# EAGLE schematic isd primary mcu (EAGLE 9.6.2)
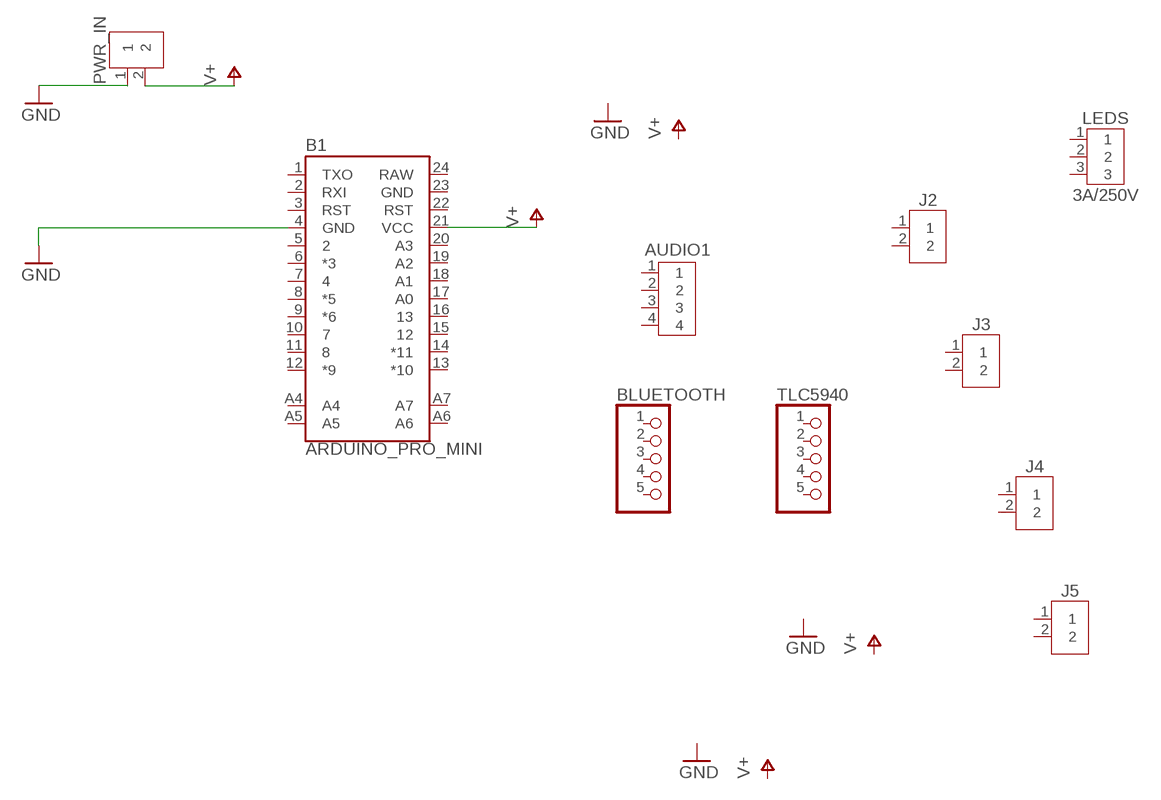
[diagram p0: schematic, sheet 1]

## Parts
AUDIO1  B4B-XH-A  [B4B-XH-A]
B1  ARDUINO_PRO_MINI  [ARDUINO_PRO_MINI]
BLUETOOTH  PINHD-1X5  [1X05]
J2  B2B-XH-A  [B2B-XH-A]
J3  B2B-XH-A  [B2B-XH-A]
J4  B2B-XH-A  [B2B-XH-A]
J5  B2B-XH-A  [B2B-XH-A]
LEDS  3A/250V  B3B-XH-A  [B3B-XH-A]
PWR_IN  B2B-XH-A  [B2B-XH-A]
TLC5940  PINHD-1X5  [1X05]

## Nets
GND: B1.4(GND) PWR_IN.1
V+: B1.21(VCC) PWR_IN.2
Unconnected: AUDIO1.1 AUDIO1.2 AUDIO1.3 AUDIO1.4 B1.1(TXO) B1.2(RXI) B1.3(RST) B1.5 B1.6(*3) B1.7 B1.8(*5) B1.9(*6) B1.10 B1.11 B1.12(*9) B1.13(*10) B1.14(*11) B1.15 B1.16 B1.17(A0) B1.18(A1) B1.19(A2) B1.20(A3) B1.22(RST) B1.A4 B1.A5 B1.A6 B1.A7 BLUETOOTH.1 BLUETOOTH.2 BLUETOOTH.3 BLUETOOTH.4 BLUETOOTH.5 J2.1 J2.2 J3.1 J3.2 J4.1 J4.2 J5.1 J5.2 LEDS.1 LEDS.2 LEDS.3 TLC5940.1 TLC5940.2 TLC5940.3 TLC5940.4 TLC5940.5

## Power pins joined to a net without a drawn wire
GND: B1.23(GND)
RAW: B1.24(RAW)

## Library data of the parts
AUDIO1 = Connector:B4B-XH-A: XH Connector Top Entry - 4POS Details see: Datasheet <http://www.jst-mfg.com/product/pdf/eng/eXH.pdf>; CATEGORY: CONNECTOR; DSECRIPTION: 2.5mm pitch/disconnctable crimp style connector; MANUFACTURER: JST (XH connector); MPN: B4B-XH-A; OPERATING_TEMPERATURE: -25 C to 85 C; PART_STATUS: ACTIVE; ROHS_COMPLIANT: COMPLAINT; SERIES: B4B-XH-A; SUB_CATEGORY: Through hole; TYPE: TOP ENTRY; VALUE: 3A/250V
B1 = SparkFun-Boards:ARDUINO_PRO_MINI: SparkFun Pro Mini Pro Mini compatible footprint. Dimensions: 0.7 x 1.3" PCB Thickness: 0.8mm SparkFun Products: 3.3V/8MHz <https://www.sparkfun.com/products/11114> 5V/16MHz <https://www.sparkfun.com/products/11113>
BLUETOOTH TLC5940 = Connector:PINHD-1X5: PIN HEADER; CATEGORY: CONNECTOR; SUB-CATEGORY: PIN-HEADER
J2-J5 PWR_IN = Connector:B2B-XH-A: XH Connector Top Entry - 2POS Details see: Datasheet <http://www.jst-mfg.com/product/pdf/eng/eXH.pdf>; CATEGORY: CONNECTOR; DESCRIPTION: 2.5mm pitch/disconnectable crimp style connector; MANUFACTURER: JST (XH CONNECTOR); MPN: B2B-XH-A; OPERATING_TEMPERATURE: -25°C ~ 85°C; PART_STATUS: ACTIVE; ROHS_COMPLIANT: COMPLIANT; SERIES: B_B-XH-A; SUB_CATEGORY: Through hole connector; TYPE: top entry; VALUE: 3A/250V
LEDS = Connector:B3B-XH-A: XH Connector Top Entry - 3POS Details see: Datasheet <http://www.jst-mfg.com/product/pdf/eng/eXH.pdf>; CATEGORY: CONNECTOR; DESCRIPTION: 2.5mm pitch/disconnectable crimp style connector; MANUFACTURER: JST (XH connector); MPN: B3B-XH-A; PART_STATUS: ACTIVE; ROHS_COMPLIANT: COMPLIANT; SERIES: B3B-XH-A; SUB_CATEGORY: THROUGH HOLE CONNECTOR; TYPE: SIDE ENTRY